# EAGLE board mbmc_single_board (EAGLE 9.6.2)
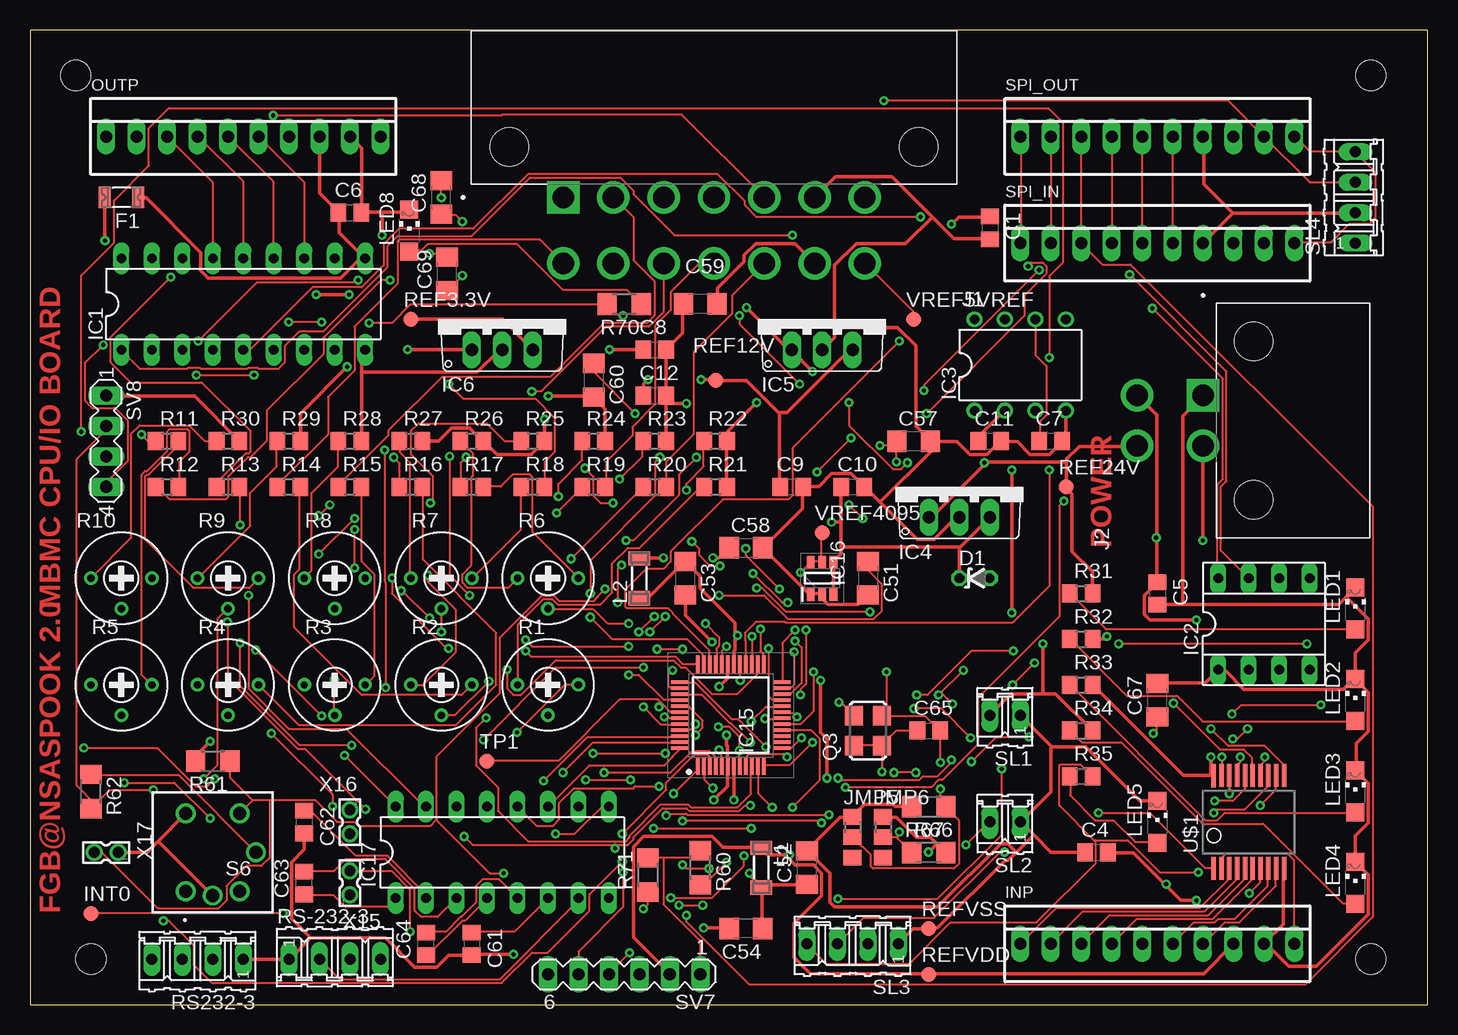
[diagram p1: board, top side]
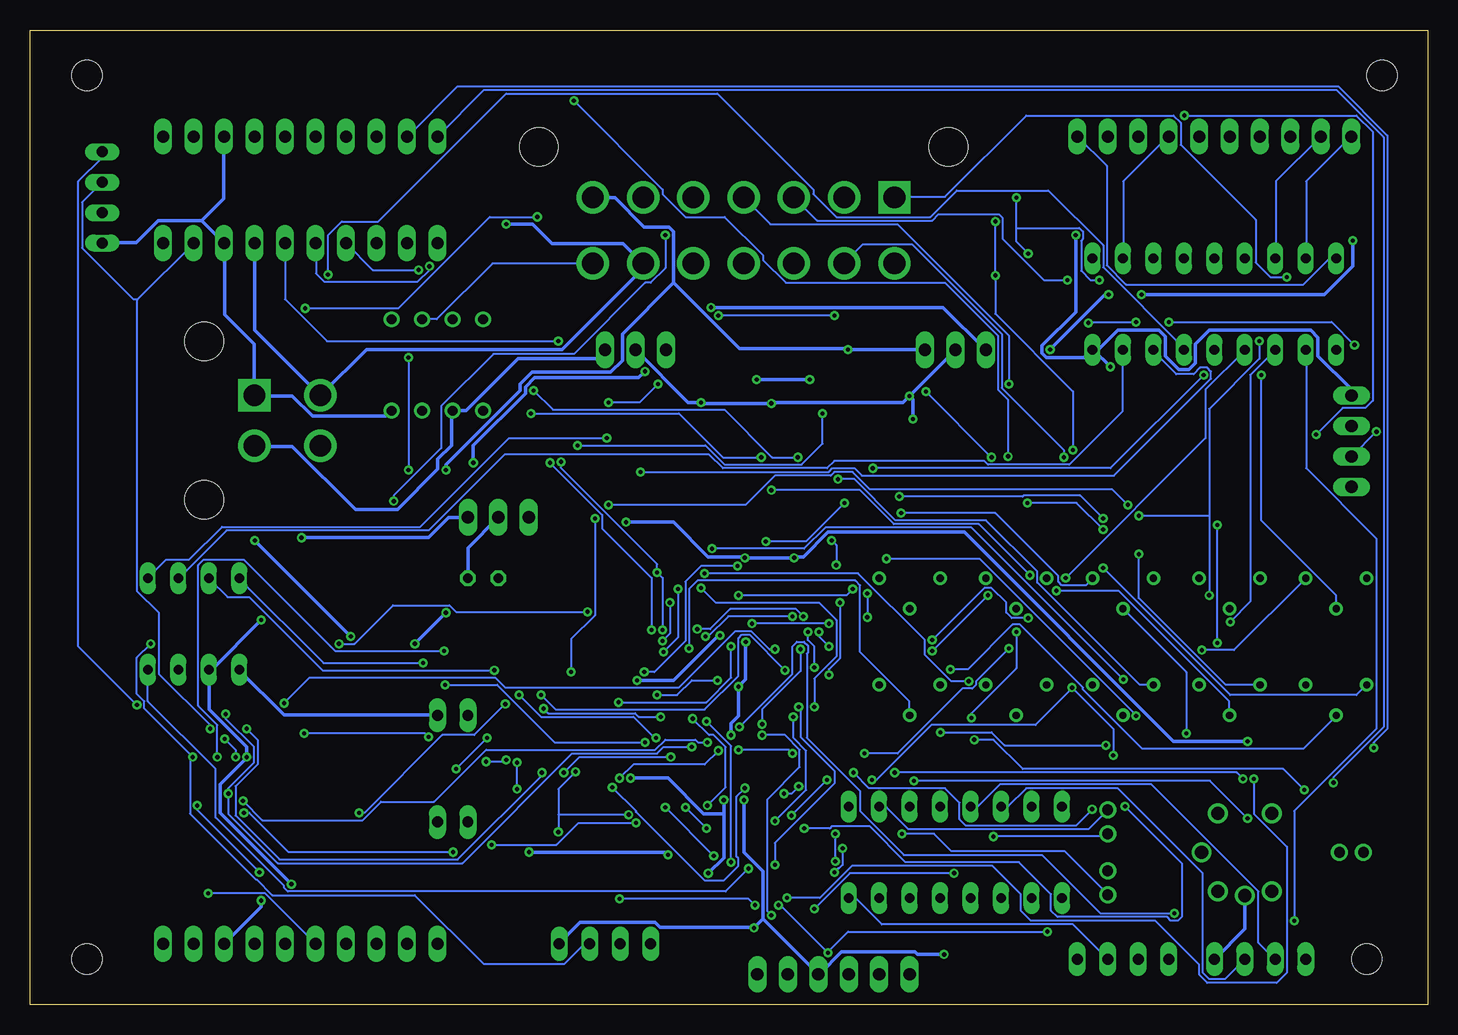
[diagram p2: board, bottom side, seen from below]

Size 116.51 x 81.27 mm. Coordinates in mm from the lower left corner, seen from the top.
Outline: 0,0 116.51,0 116.51,81.27 0,81.27 0,0
Copper layers (1*16): Top 0.035mm / dielectric 1.5mm / Bottom 0.035mm
Design rules "default": minimum track width 6mil, minimum drill 0.35mm, track to track 6mil, track to pad 6mil, pad to pad 6mil, via to via 6mil, smd to smd 6mil, copper to edge 40mil, drill to drill 6mil, minimum pad ring 10mil, minimum via ring 8mil, stop-mask expansion 4mil, vias tented up to drill 0mil, thermal gap 10mil
Net classes: 1 i-line: width 0.3 mm
Holes 2.5 mm at 5.08,3.81 111.76,3.81 111.76,77.47 3.81,77.47

## Footprints (pad centres in the part's own frame; a part is rotated, then mirrored left to right if it is on the bottom)
C0805 = smd 1.3 x 1.5: 1 -0.95,0; 2 0.95,0
C1206 = smd 1.6 x 1.8: 1 -1.4,0; 2 1.4,0
ZDIO-2.5 = drill 0.813 octagon: A 1.27,0; C -1.27,0
1206L = smd 1 x 1.8: 1 -1.4,0; 2 1.4,0
DIL18 = drill 0.813 long: 1 -10.16,-3.81; 2 -7.62,-3.81; 3 -5.08,-3.81; 4 -2.54,-3.81; 5 0,-3.81; 6 2.54,-3.81; 7 5.08,-3.81; 8 7.62,-3.81; 9 10.16,-3.81; 10 10.16,3.81; 11 7.62,3.81; 12 5.08,3.81; 13 2.54,3.81; 14 0,3.81; 15 -2.54,3.81; 16 -5.08,3.81; 17 -7.62,3.81; 18 -10.16,3.81
SOCKET-08 = drill 0.813 long: 1 -3.81,-3.81; 2 -1.27,-3.81; 3 1.27,-3.81; 4 3.81,-3.81; 5 3.81,3.81; 6 1.27,3.81; 7 -1.27,3.81; 8 -3.81,3.81
DIL08 = drill 0.813 pad 1.27: 1 -3.81,-3.81; 2 -1.27,-3.81; 3 1.27,-3.81; 4 3.81,-3.81; 5 3.81,3.81; 6 1.27,3.81; 7 -1.27,3.81; 8 -3.81,3.81
TO220V = drill 1.016 long: 1 -2.54,-2.54; 2 0,-2.54; 3 2.54,-2.54
QFP50P900X900X120-48N = smd 1.475 x 0.3: 1 -4.238,2.75; 2 -4.238,2.25; 3 -4.238,1.75; 4 -4.238,1.25; 5 -4.238,0.75; 6 -4.238,0.25; 7 -4.238,-0.25; 8 -4.238,-0.75; 9 -4.238,-1.25; 10 -4.238,-1.75; 11 -4.238,-2.25; 12 -4.238,-2.75; 25 4.238,-2.75; 26 4.238,-2.25; 27 4.238,-1.75; 28 4.238,-1.25; 29 4.238,-0.75; 30 4.238,-0.25; 31 4.238,0.25; 32 4.238,0.75; 33 4.238,1.25; 34 4.238,1.75; 35 4.238,2.25; 36 4.238,2.75 | smd 0.3 x 1.475: 13 -2.75,-4.238; 14 -2.25,-4.238; 15 -1.75,-4.238; 16 -1.25,-4.238; 17 -0.75,-4.238; 18 -0.25,-4.238; 19 0.25,-4.238; 20 0.75,-4.238; 21 1.25,-4.238; 22 1.75,-4.238; 23 2.25,-4.238; 24 2.75,-4.238; 37 2.75,4.238; 38 2.25,4.238; 39 1.75,4.238; 40 1.25,4.238; 41 0.75,4.238; 42 0.25,4.238; 43 -0.25,4.238; 44 -0.75,4.238; 45 -1.25,4.238; 46 -1.75,4.238; 47 -2.25,4.238; 48 -2.75,4.238
SOP95P280X145-6N = smd 1.075 x 0.65: 1 -1.338,0.95; 2 -1.338,0; 3 -1.338,-0.95; 4 1.338,-0.95; 5 1.338,0; 6 1.338,0.95
DIL16 = drill 0.813 long: 1 -8.89,-3.81; 2 -6.35,-3.81; 3 -3.81,-3.81; 4 -1.27,-3.81; 5 1.27,-3.81; 6 3.81,-3.81; 7 6.35,-3.81; 8 8.89,-3.81; 9 8.89,3.81; 10 6.35,3.81; 11 3.81,3.81; 12 1.27,3.81; 13 -1.27,3.81; 14 -3.81,3.81; 15 -6.35,3.81; 16 -8.89,3.81
22-23-2101 = drill 1 long: 1 -11.43,0; 2 -8.89,0; 3 -6.35,0; 4 -3.81,0; 5 -1.27,0; 6 1.27,0; 7 3.81,0; 8 6.35,0; 9 8.89,0; 10 11.43,0
B1,27 = smd 1.27 x 1.27: TP 0,0
TE_1-1586043-4 = drill 1.8 pad 2.15 square: 1 0,0 | drill 1.8 pad 2.15: 2 0,5.5; 3 -4.19,0; 4 -4.19,5.5; 5 -8.38,0; 6 -8.38,5.5; 7 -12.57,0; 8 -12.57,5.5; 9 -16.76,0; 10 -16.76,5.5; 11 -20.95,0; 12 -20.95,5.5; 13 -25.14,0; 14 -25.14,5.5 | hole 3.2: -29.64,-4.2; 4.5,-4.2
TE_1586044-4 = drill 1.8 pad 2.15 square: 1 0,0 | drill 1.8 pad 2.15: 2 0,5.5; 3 -4.19,0; 4 -4.19,5.5 | hole 3.2: -8.69,-4.2; 4.5,-4.2
A0R-JMP = smd 1.5 x 1.3: 1 0,1.7; 2 0,0; 3 0,-1.7
SM-1206 = smd 1.2 x 1.8: 1 -1.65,0; 2 1.65,0
CHIPLED_1206 = smd 1.5 x 1.5: A 0,-1.75; C 0,1.75
ASF = smd 1.6 x 1.5: 1 -1.25,-1.15; 2 1.25,-1.15; 3 1.25,1.15; 4 -1.25,1.15
RTRIM3339P = drill 0.61: 1 -2.54,0; 2 0,-2.54; 3 2.54,0
R0805 = smd 1.3 x 1.5: 1 -0.95,0; 2 0.95,0
R1206 = smd 1.6 x 1.803: 1 -1.422,0; 2 1.422,0
04P = drill 0.914 long: 1 -3.81,0; 2 -1.27,0; 3 1.27,0; 4 3.81,0
B3W-9_1-LED = drill 1.1 pad 1.65: 1 3.25,-2.25; 2 -3.25,-2.25; 3 3.25,2.25; 4 -3.25,2.25; 5 0,3.6; 6 3.6,0
02P = drill 0.914 long: 1 -1.27,0; 2 1.27,0
MA06-1 = drill 1.016 long: 1 -6.35,0; 2 -3.81,0; 3 -1.27,0; 4 1.27,0; 5 3.81,0; 6 6.35,0
MA04-1 = drill 1.016 long: 1 -3.81,0; 2 -1.27,0; 3 1.27,0; 4 3.81,0
SSOP20 = smd 0.381 x 1.93: CH_L 2.925,3.879; EN_L -2.925,-3.879; GND 2.925,-3.879; IN1 -2.275,-3.879; IN2 -1.625,-3.879; IN3 -0.975,-3.879; IN4 -0.325,-3.879; IN5 0.325,-3.879; IN6 0.975,-3.879; IN7 1.625,-3.879; IN8 2.275,-3.879; OUT1 -2.275,3.879; OUT2 -1.625,3.879; OUT3 -0.975,3.879; OUT4 -0.325,3.879; OUT5 0.325,3.879; OUT6 0.975,3.879; OUT7 1.625,3.879; OUT8 2.275,3.879; VCC -2.917,3.868
332-02 = drill 0.9 pad 1.27: 1 0,-1; 2 0,1

## Placement (x,y rotation side)
C1  22uf  [C0805]  80.01,64.77 270 top
C4  0.1  [C0805]  88.9,12.7 0 top
C5  0.1  [C0805]  93.98,34.29 270 top
C6  0.1  [C0805]  26.67,66.04 0 top
C7  0.1  [C0805]  85.09,46.99 0 top
C8  0.1  [C0805]  52.07,54.61 0 top
C9  0.1  [C0805]  63.5,43.18 0 top
C10  0.1  [C0805]  68.58,43.18 0 top
C11  0.1  [C0805]  80.01,46.99 0 top
C12  22uf  [C0805]  52.07,50.8 0 top
C51  0.1  [C1206]  69.85,35.56 270 top
C52  0.1  [C1206]  64.77,11.43 90 top
C53  0.1  [C1206]  54.61,35.56 270 top
C54  15uf  [C1206]  59.69,6.35 180 top
C57  0.1  [C1206]  73.66,46.99 0 top
C58  0.1  [C1206]  59.69,38.1 0 top
C59  15uf  [C1206]  55.88,58.42 180 top
C60  15uf  [C1206]  46.99,52.07 270 top
C61  1uf  [C0805]  36.83,5.08 270 top
C62  1uf  [C0805]  22.86,15.24 270 top
C63  1uf  [C0805]  22.86,10.16 90 top
C64  1uf  [C0805]  33.02,5.08 90 top
C65  1uf  [C0805]  74.93,22.86 0 top
C67  0.1  [C1206]  93.98,25.4 90 top
C68  0.1  [C1206]  34.29,67.31 90 top
C69  0.1  [C1206]  34.77,60.93 90 top
D1  5.6v  [ZDIO-2.5]  78.74,35.56 0 top
F1  1206L050  [1206L]  7.62,67.31 180 top
IC1  ULN2803  [DIL18]  17.78,58.42 0 top
IC2  DIP Socket  [SOCKET-08]  102.87,31.75 0 top
IC3  REF02 5 VOLTS  [DIL08]  82.55,53.34 0 top
IC4  5 VOLTS  [TO220V]  77.47,43.18 0 top
IC5  12 VOLTS  [TO220V]  66.04,57.15 0 top
IC6  3.3 VOLTS  [TO220V]  39.37,57.15 0 top
IC15  PIC18F57K42-E_PT  [QFP50P900X900X120-48N]  58.42,24.13 90 top
IC16  REF3440IDBVR  [SOP95P280X145-6N]  66.04,35.56 90 top
IC17  MAX232  [DIL16]  39.37,12.7 0 top
INP  22-23-2101  [22-23-2101]  93.98,5.08 0 top
INT0  TPB1,27  [B1,27]  5.08,7.62 0 top
J1  1-1586043-4  [TE_1-1586043-4]  44.45,67.31 180 top
J2  1586044-4  [TE_1586044-4]  97.79,50.8 90 top
JMP5  0R-JUMPA  [A0R-JMP]  68.58,13.97 0 top
JMP6  0R-JUMPA  [A0R-JMP]  71.12,13.97 0 top
L1  1000  [SM-1206]  60.96,11.43 270 top
L2  1000  [SM-1206]  50.8,35.56 90 top
LED1  24 on  [CHIPLED_1206]  110.49,33.02 0 top
LED2  12 on  [CHIPLED_1206]  110.49,25.4 0 top
LED3  5 on  [CHIPLED_1206]  110.49,17.78 0 top
LED4  3.3 on  [CHIPLED_1206]  110.49,10.16 0 top
LED5  debug8  [CHIPLED_1206]  93.98,15.24 0 top
LED8  DBLED  [CHIPLED_1206]  31.62,64.54 0 top
OUTP  22-23-2101  [22-23-2101]  17.78,72.39 0 top
Q3  ASF1  [ASF]  69.85,22.86 90 top
R1  200  [RTRIM3339P]  43.18,26.67 0 top
R2  200  [RTRIM3339P]  34.29,26.67 0 top
R3  200  [RTRIM3339P]  25.4,26.67 0 top
R4  200  [RTRIM3339P]  16.51,26.67 0 top
R5  200  [RTRIM3339P]  7.62,26.67 0 top
R6  200  [RTRIM3339P]  43.18,35.56 0 top
R7  200  [RTRIM3339P]  34.29,35.56 0 top
R8  200  [RTRIM3339P]  25.4,35.56 0 top
R9  200  [RTRIM3339P]  16.51,35.56 0 top
R10  200  [RTRIM3339P]  7.62,35.56 0 top
R11  9.85k  [R0805]  11.43,46.99 0 top
R12  21.5k  [R0805]  11.43,43.18 0 top
R13  811  [R0805]  16.51,43.18 0 top
R14  811  [R0805]  21.59,43.18 0 top
R15  9.85k  [R0805]  26.67,43.18 0 top
R16  9.85k  [R0805]  31.75,43.18 0 top
R17  9.85k  [R0805]  36.83,43.18 0 top
R18  9.85k  [R0805]  41.91,43.18 0 top
R19  811  [R0805]  46.99,43.18 0 top
R20  21.5k  [R0805]  52.07,43.18 0 top
R21  3820  [R0805]  57.15,43.18 0 top
R22  3820  [R0805]  57.15,46.99 0 top
R23  1.28k  [R0805]  52.07,46.99 0 top
R24  1.28k  [R0805]  46.99,46.99 0 top
R25  1.28k  [R0805]  41.91,46.99 0 top
R26  1.28k  [R0805]  36.83,46.99 0 top
R27  1.28k  [R0805]  31.75,46.99 0 top
R28  3820  [R0805]  26.67,46.99 0 top
R29  1.28k  [R0805]  21.59,46.99 0 top
R30  1.28k  [R0805]  16.51,46.99 0 top
R31  10k  [R0805]  87.63,34.29 0 top
R32  5k  [R0805]  87.63,30.48 0 top
R33  1k  [R0805]  87.63,26.67 0 top
R34  1k  [R0805]  87.63,22.86 0 top
R35  1k  [R0805]  87.63,19.05 0 top
R60  220  [R1206]  55.88,11.43 270 top
R61  10000  [R1206]  15.24,20.32 180 top
R62  220  [R1206]  5.08,17.78 270 top
R66  0  [R1206]  74.93,12.7 0 top
R67  0  [R1206]  74.93,16.51 180 top
R70  220  [R1206]  49.53,58.42 180 top
R71  220  [R1206]  51.51,10.82 90 top
REF3.3V  TPB1,27  [B1,27]  31.75,57.15 0 top
REF12V  TPB1,27  [B1,27]  57.15,52.07 0 top
REF24V  TPB1,27  [B1,27]  86.36,43.18 0 top
REFVDD  TPB1,27  [B1,27]  74.93,2.54 0 top
REFVSS  TPB1,27  [B1,27]  74.93,6.35 0 top
RS232-3  serial1  [04P]  13.97,3.81 180 top
RS-232-3  serial2  [04P]  25.4,3.81 0 top
S6  RESET SW  [B3W-9_1-LED]  15.24,12.7 270 top
SL1  3.3 GLORY  [02P]  81.28,24.13 180 top
SL2  PWM  [02P]  81.28,15.24 180 top
SL3  MISC INP  [04P]  68.58,5.08 180 top
SL4  SPI SEL  [04P]  110.49,67.31 90 top
SPI_IN  22-23-2101  [22-23-2101]  93.98,63.5 0 top
SPI_OUT  22-23-2101  [22-23-2101]  93.98,72.39 0 top
SV7  ICSP  [MA06-1]  49.53,2.54 180 top
SV8  DEBUG  [MA04-1]  6.35,46.99 270 top
TP1  TPB1,27  [B1,27]  38.1,20.32 0 top
U$1  MAX6818  [SSOP20]  101.6,15.24 0 top
VREF5VREF  TPB1,27  [B1,27]  73.66,57.15 0 top
VREF4095  TPB1,27  [B1,27]  66.04,39.37 0 top
X15  RX-2  [332-02]  26.67,10.16 0 top
X16  TX-2  [332-02]  26.67,15.24 180 top
X17  RESETJMP  [332-02]  6.35,12.7 90 top

## Tracks (layer width: path | path; a pad name or v marks a point on that pad's centre or on a via)
+3V3  (via drill 0.35)
  Top 0.3: 84.43,25.91 81.76,25.91 80.01,24.16 SL1.2 | 84.43,25.91 85.5,25.91 88.54,22.86 R34.2 | REF3.3V.TP 39.4,57.15 41.91,54.63 IC6.3 | v48.31,54.63 51.05,54.63 C8.1 | v84.43,30.1 84.43,25.91 | v81.84,44.58 v81.84,32.69
  Bottom 0.3: IC6.3 41.91,54.63 v48.31,54.63 48.39,54.71 57.38,54.71 62.87,60.2 | 62.87,60.2 62.87,64.47 63.25,64.85 65.3,64.85 67.74,67.28 69.57,67.28 J1.13 | v81.84,32.69 v84.43,30.1 | v81.84,44.58 81.84,45.03 75.67,51.21 75.67,51.74 74.68,52.73 68.12,52.73 67.13,53.72 67.13,55.93 62.87,60.2
+12V  (via drill 0.35)
  Top 0.3: R32.2 89.53,30.48 v89.76,30.71 | v97.77,38.71 97.77,46.56 J2.3 | C11.1 79.1,47.02 79.1,47.4 81.23,49.53 IC3.2 | 62.48,49.3 59.74,52.05 57.15,52.05 REF12V.TP 57.07,52.12 v55.93,52.12 | 62.48,49.3 62.48,43.2 C9.1 | v51.51,52.12 51.13,51.74 51.13,50.83 C12.1 | IC5.3 68.58,54.56 68.28,54.56 63.09,49.38 62.56,49.38 62.48,49.3
  Bottom 0.3: v97.77,38.71 v89.76,30.71 | v55.93,52.12 v51.51,52.12 | IC5.3 68.58,54.56 69.27,53.87 75.82,53.87 80.16,49.53 IC3.2 81.38,49.45 81.38,46.63 82.53,45.49 82.53,44.65 85.88,41.3 89.38,41.3 94.64,46.56 97.77,46.56 J2.3
+24V  (via drill 0.35)
  Top 0.3: 86.41,45.26 86.41,45.49 87.48,46.56 92.28,46.56 J2.4 | 86.41,45.26 86.41,43.2 REF24V.TP 86.41,43.05 86.87,42.6 86.87,37.8 88.54,36.12 88.54,34.29 R31.2 | 79.63,45.11 79.78,45.26 86.41,45.26 | 79.63,45.11 75.21,40.69 74.98,40.69 IC4.1 | v6.25,63.7 6.25,67.28 F1.2 | v26.59,59.21 v23.85,59.21 | v31.47,54.63 36.8,54.63 IC6.1 | v59.74,58.14 63.25,54.63 63.48,54.63 IC5.1 63.55,54.48 v65.23,52.81 | v79.55,45.19 79.63,45.11
  Bottom 0.3: v6.25,63.7 6.25,61.57 8.61,59.21 v23.85,59.21 | v26.59,59.21 26.9,59.21 v31.47,54.63 | v59.74,58.14 40.39,58.14 36.88,54.63 IC6.1 | v79.55,45.19 79.55,46.63 75.21,50.98 75.21,51.51 74.45,52.27 65.76,52.27 v65.23,52.81
AC_CHARGER  (via drill 0.35)
  Top 0.152: v47.85,19.36 53.42,19.36 55.24,21.18 56.62,21.18 57.15,20.65 57.15,19.96 IC15.4 | v27.96,16.31 22.94,21.34 22.33,21.34 16.46,27.2 v16.46,31.93
  Bottom 0.152: v47.85,19.36 46.56,18.06 40.23,18.06 39.01,16.84 39.01,15.47 38.48,14.94 29.34,14.94 v27.96,16.31 | v16.46,31.93 14.78,33.6 14.78,52.5 12.72,54.56 IC1.3
ANA0_IN_C_BAT  (via drill 0.35)
  Top 0.152: v11.73,60.66 6.71,55.63 6.71,53.57 8.38,51.89 14.33,51.89 18.36,47.85 18.36,46.1 18.21,45.95 17.98,45.95 15.62,43.59 15.62,43.2 R13.1
  Bottom 0.152: v11.73,60.66 13.11,60.66 14.33,61.87 14.33,65.46 20.57,71.7 20.57,73.53 21.18,74.14 33.45,74.14 40.23,67.36 44.42,67.36 J1.1
ANA1_IN_C-PV
  Top 0.152: R14.1 20.65,43.2 20.65,43.36 24.84,47.55 24.84,50.67 27.05,52.88 27.05,56.54 30.63,60.12 30.63,63.63 30.79,63.78 42.52,63.78 44.42,61.87 J1.2
ANA2_IN_V_CC
  Top 0.152: R15.1 25.76,43.2 25.76,43.36 29.87,47.47 29.87,47.85 34.37,52.35 43.36,52.35 47.85,56.84 51.44,56.84 52.05,57.45 52.05,60.35 50.29,62.1 50.29,65.68 48.69,67.28 J1.3
ANA4_IN_V_BAT  (via drill 0.35)
  Top 0.152: v30.33,45.64 30.79,45.19 30.79,43.2 R16.1
  Bottom 0.152: v30.33,45.64 30.33,46.25 35.51,51.44 35.51,55.93 42.98,63.4 47.09,63.4 48.62,61.87 J1.4
ANA5_IN_V_PV  (via drill 0.35)
  Top 0.152: v30.02,60.43 29.26,60.43 24.46,55.63 24.46,54.25 19.74,49.53 19.74,47.02 18.36,45.64 18.14,45.64 16.54,44.04 16.54,42.37 16.31,42.14 11.66,42.14 10.67,43.13 10.52,43.13 R12.1
  Bottom 0.152: v30.02,60.43 32,60.43 35.43,63.86 35.43,65.61 35.74,65.91 40.77,65.91 41.3,65.38 50.9,65.38 52.81,67.28 J1.5
ANA6_IN_V_CMODE  (via drill 0.35)
  Top 0.152: v36.35,45.64 35.89,45.19 35.89,43.2 R17.1 | v41.83,51.13 42.6,51.13 48.01,56.54 51.59,56.54 52.81,57.76 52.81,61.8 J1.6
  Bottom 0.152: v41.83,51.13 v36.35,45.64
ANB2_IN_V_BBAT  (via drill 0.35)
  Top 0.152: v34.9,51.74 36.12,50.52 42.14,50.52 43.74,48.92 43.74,46.1 42.9,45.26 42.9,43.2 R18.2
  Bottom 0.152: v34.9,51.74 34.9,55.78 44.2,65.08 54.79,65.08 57,67.28 J1.7
ANB3_IN_C_MPPT
  Top 0.152: R19.2 48.01,43.2 48.01,45.26 50.22,47.47 50.22,48.16 52.12,50.06 52.12,56.62 53.42,57.91 53.42,59.44 55.78,61.8 57,61.8 J1.8
ANB4_IN_V_INVERTER  (via drill 0.35)
  Top 0.152: v9.3,47.55 9.83,47.02 10.44,47.02 R11.1 | v20.27,74.14 39.32,74.14 39.4,74.22 54.33,74.22 61.19,67.36 J1.9
  Bottom 0.152: v9.3,47.55 7.09,49.76 5.18,49.76 4.57,50.37 4.57,72.77 5.94,74.14 v20.27,74.14
ANB5_IN_V_L_SENSOR
  Top 0.152: R20.2 53.03,43.2 53.03,45.26 55.32,47.55 55.32,54.41 58.52,57.61 58.52,59.13 61.19,61.8 J1.10
C_BATT  (via drill 0.35)
  Top 0.152: v61.57,29.72 61.57,25.76 61.87,25.45 62.64,25.45 IC15.21
  Bottom 0.152: v61.57,29.72 61.57,34.67 60.88,35.36 47.7,35.36 47.32,34.98 47.32,29.41 43.2,25.3 43.2,24.16 R1.2
C_MPPT  (via drill 0.35)
  Top 0.152: v61.87,16.46 60.73,17.6 60.73,19.89 IC15.11 | v51.97,14.71 v60.12,14.71 | v25.22,16.54 25.22,17.53 v20.12,22.63
  Bottom 0.152: v60.12,14.71 v61.87,16.46 | v51.97,14.71 49.84,14.71 49.68,14.86 46.48,14.86 43.51,11.89 34.06,11.89 31.39,9.22 31.39,7.85 30.86,7.32 21.72,7.32 21.41,7.01 20.8,7.01 20.5,7.32 20.5,11.81 v25.22,16.54 | v20.12,22.63 20.12,27.74 R8.2
C_PV  (via drill 0.35)
  Top 0.152: v63.78,30.33 64.31,29.79 64.31,26.82 63.4,25.91 62.71,25.91 IC15.22 | v63.17,33.53 62.71,33.53 v60.27,35.97 | v38.25,26.98 35.43,24.16 34.29,24.16 R2.2
  Bottom 0.152: v63.78,30.33 63.17,30.94 v63.17,33.53 | v60.27,35.97 47.47,35.97 41.91,30.4 41.91,29.18 39.7,26.98 v38.25,26.98
CAL_SW
  Top 0.152: U$1.IN5 101.88,11.35 101.88,10.44 98.6,7.16 92.28,7.16 90.22,5.11 INP.4
CALIB_B  (via drill 0.35)
  Top 0.152: v55.47,23.39 55.02,22.94 54.25,22.94 IC15.45 | v54.41,29.64 v52.27,29.64 | v95.33,25.15 99.21,21.26 101.19,21.26 101.88,20.57 101.88,19.13 U$1.OUT5
  Bottom 0.152: v55.47,23.39 55.47,24.61 52.27,27.81 v52.27,29.64 | v54.41,29.64 54.86,29.64 56.39,31.17 57.68,31.17 62.41,26.44 76.89,26.44 77.72,27.28 93.19,27.28 v95.33,25.15
CLK16MHZCPU  (via drill 0.35)
  Top 0.152: v58.06,29.87 57.68,29.49 57.68,28.42 IC15.32 | v67.44,25.22 67.59,25.22 68.66,24.16 Q3.3
  Bottom 0.152: v58.06,29.87 58.06,27.28 60.12,25.22 v67.44,25.22
DAQ_CS0  (via drill 0.35)
  Top 0.152: v99.36,20.65 99.36,19.13 U$1.OUT1 | v100.28,22.17 100.66,22.17 v101.5,23.01 | v41.3,29.49 41.76,29.03 53.8,29.03 54.41,28.42 55.63,28.42 IC15.36 | v36.65,34.14 34.98,35.81 v34.98,45.72 | v71.17,75.36 99.9,75.36 SPI_OUT.9 106.68,68.58 SL4.3
  Bottom 0.152: v99.36,20.65 99.36,21.26 v100.28,22.17 | v101.5,23.01 101.5,23.32 105.77,27.58 105.77,32.69 107.59,34.52 107.59,58.75 107.56,58.79 | 107.56,58.79 102.87,63.48 SPI_IN.9 | v36.65,34.14 v41.3,29.49 | v34.98,45.72 34.98,50.44 35.81,51.28 35.81,55.78 40.23,60.2 53.49,60.2 55.4,62.1 55.4,62.48 58.6,65.68 61.87,65.68 63.78,67.59 63.78,67.97 v71.17,75.36 | SL4.3 112.17,66.9 112.17,63.09 107.9,58.83 107.59,58.83 107.56,58.79
DEBUG8_LED  (via drill 0.35)
  Top 0.152: 88.73,13.68 88.85,13.56 88.85,11.81 83.9,6.86 76.73,6.86 73.3,3.43 66.37,3.43 64.77,5.03 SL3.4 | 88.73,13.68 85.8,16.61 85.8,19.96 85.88,20.04 87.55,20.04 88.54,19.05 R35.2 | v102.56,16.61 103.86,17.91 103.86,19.05 U$1.OUT8 | v97.38,11.05 94.18,11.05 91.52,13.72 88.77,13.72 88.73,13.68
  Bottom 0.152: v102.56,16.61 102.56,16.23 v97.38,11.05
DIP_P5  (via drill 0.35)
  Top 0.152: v68.43,47.24 v65.61,44.42
  Bottom 0.152: v65.61,44.42 49.91,44.42 49.61,44.73 47.78,44.73 47.17,44.12 26.14,44.12 18.06,52.2 18.06,52.81 18.36,53.11 18.97,53.11 19.51,52.58 20.95,52.58 22.25,53.87 22.25,53.95 22.86,54.56 IC1.7 | v68.43,47.24 76.58,47.24 83.97,39.85 100.51,39.85 103.25,37.11 105.16,37.11 106.68,35.59 IC2.5
DIP_P6
  Bottom 0.152: IC2.6 104.09,35.59 100.13,39.55 83.29,39.55 76.96,45.87 59.89,45.87 58.75,44.73 50.06,44.73 49.45,45.34 36.96,45.34 36.65,45.03 29.87,45.03 25.45,49.45 25.45,54.56 IC1.8
DLED  (via drill 0.35)
  Top 0.152: v59.21,27.05 59.21,28.35 IC15.29 | v64.24,25.83 64.24,26.29 64.69,26.75 v64.69,31.24 | v73.15,45.19 72.62,44.65 71.93,44.65 68.28,48.31 v68.28,50.22 | v64.16,51.74 59.13,56.77 v59.13,57.45 | v49.45,57.45 49.07,57.45 48.16,58.37 R70.2 48.08,58.37 31.7,58.37 30.18,56.84 v28.27,56.84 | v6.1,55.02 4.57,53.49 4.57,50.37 5.18,49.76 7.09,49.76 8.15,48.69 8.15,45.34 6.4,43.59 6.4,43.2 SV8.4 | v24.31,56.92 v21.57,56.92
  Bottom 0.152: v59.21,27.05 61.34,27.05 62.56,25.83 v64.24,25.83 | v64.69,31.24 64.69,35.59 68.81,39.7 68.81,40.84 v73.15,45.19 | v68.28,50.22 65.68,50.22 v64.16,51.74 | v49.45,57.45 v59.13,57.45 | v6.1,55.02 8,56.92 v21.57,56.92 | v24.31,56.92 28.19,56.92 v28.27,56.84
ENTER_B  (via drill 0.35)
  Top 0.152: v60.05,21.87 58.45,23.47 58.37,23.47 56.01,25.83 54.25,25.83 IC15.39 | v98.75,16.99 100.28,16.99 101.27,17.98 101.27,19.05 U$1.OUT4
  Bottom 0.152: v60.05,21.87 60.81,21.87 61.04,22.1 63.55,22.1 64.39,21.26 78.49,21.26 82.83,16.92 87.25,16.92 88.77,15.39 97.16,15.39 v98.75,16.99
EXT_INT0  (via drill 0.35)
  Top 0.152: v21.11,7.62 INT0.TP | v57.38,23.16 58.29,23.16 59.13,22.33 v59.13,21.18 59.13,19.96 IC15.8 | v93.65,22.63 93.95,22.94 93.95,23.93 C67.1 | v83.29,22.33 80.54,22.33 v78.49,20.27 | v76.81,20.42 76.81,20.19 75.67,19.05 74.45,19.05 74.14,18.75 67.51,18.75 v67.36,18.9
  Bottom 0.152: v21.11,7.62 27.28,7.62 32.16,12.5 43.66,12.5 47.32,16.15 47.32,17.83 51.74,22.25 51.74,29.26 51.66,29.34 51.66,29.95 51.97,30.25 52.58,30.25 52.96,29.87 52.96,27.58 v57.38,23.16 | v93.65,22.63 83.59,22.63 v83.29,22.33 | v78.49,20.27 76.96,20.27 v76.81,20.42 | v67.36,18.9 66.22,20.04 60.27,20.04 v59.13,21.18
EXT_INT1  (via drill 0.35)
  Top 0.152: v63.09,20.65 62.87,20.88 59.89,20.88 59.74,20.73 59.74,19.96 IC15.9 | v73.84,19.36 v72.01,19.36 | v98.45,23.01 99.9,21.57 102.95,21.57 104.47,20.04 104.47,19.13 U$1.CH_L
  Bottom 0.152: v63.09,20.65 70.71,20.65 v72.01,19.36 | v73.84,19.36 73.84,19.13 80.85,12.12 95.71,12.12 99.36,15.77 99.36,18.21 97.54,20.04 97.54,22.1 v98.45,23.01
GND  (via drill 0.35)
  Top 0.152: 71.4,24.08 71.02,24.08 Q3.2 71.4,24.08 | 71.4,24.08 74.6,24.08 75.82,22.86 C65.2 75.89,22.86 v75.89,20.19 | JMP5.2 68.58,13.95 69.34,13.18 69.42,13.18 70.1,12.5 70.1,11.51 70.26,11.35 77.04,11.35 77.42,11.73 77.42,15.39 76.35,16.46 R67.1 76.28,16.54 75.89,16.92 v75.89,17.98 | v34.29,67.28 C68.2 | v33.3,62.64 34.52,62.64 34.75,62.41 C69.2 | v18.21,34.14 18.21,26.36 21.57,23.01 26.36,23.01 32.84,16.54 32.99,16.54 IC17.15 | v14.02,55.32 18.9,60.2 27.13,60.2 v27.36,60.43 | v71.4,27.74 71.4,24.08 | v68.28,41.68 v69.42,40.54 | v24.08,40.77 v24.99,41.68
  Bottom 0.152: v75.89,17.98 v75.89,20.19 | 34.29,64.77 34.29,63.63 v33.3,62.64 | 34.29,64.77 v34.29,67.28 | 18.21,40.77 18.21,49.68 14.02,53.87 v14.02,55.32 | 18.21,40.77 v18.21,34.14 | v27.36,60.43 28.12,60.43 28.88,61.19 28.88,63.7 28.73,63.86 28.73,64.47 29.03,64.77 34.29,64.77 | v71.4,27.74 71.4,30.48 69.42,32.46 v69.42,40.54 | v68.28,41.68 56.84,41.68 54.41,44.12 49.76,44.12 49.45,44.42 47.93,44.42 46.48,42.98 26.29,42.98 v24.99,41.68 | 18.21,40.77 v24.08,40.77
I5_ULN2803  (via drill 0.35)
  Top 0.152: v65.23,21.87 63.32,19.96 61.19,19.96 IC15.12 | v83.74,28.5 v81.92,26.67 | v74.22,65.68 60.58,65.68 59.59,66.67 59.59,66.98 57.3,69.27 41.53,69.27 36.96,64.69 30.79,64.69 29.49,63.4 29.49,61.65 27.66,59.82 23.55,59.82 18.36,54.63 17.83,54.63 IC1.5 | v93.57,58.06 99.44,52.2 99.44,43.81 98.98,43.36 98.98,35.66 99.06,35.59 IC2.8
  Bottom 0.152: v65.23,21.87 72.77,21.87 77.57,26.67 v81.92,26.67 | v83.74,28.5 92.05,28.5 99.06,35.51 IC2.8 | v74.22,65.68 78.18,65.68 85.8,58.06 v93.57,58.06
IO_RF1  (via drill 0.35)
  Top 0.152: SPI_OUT.10 105.46,72.39 106.68,71.17 110.49,71.17 SL4.4 110.49,71.09 112.17,69.42 112.17,65.61 111.63,65.08 109.96,65.08 108.43,63.55 105.46,63.55 SPI_IN.10 | v61.34,21.49 59.05,23.77 58.52,23.77 55.47,26.82 54.25,26.82 IC15.37 | v99.97,17.6 99.97,19.05 U$1.OUT2 | v107.59,24.99 100.97,24.99 v100.2,24.23
  Bottom 0.152: v61.34,21.49 63.7,21.49 64.24,20.95 71.32,20.95 80.47,11.81 95.86,11.81 99.97,15.93 v99.97,17.6 99.97,18.06 97.84,20.19 97.84,21.49 100.2,23.85 v100.2,24.23 | SL4.4 110.49,70.64 112.47,68.66 112.47,29.87 v107.59,24.99
MAX_EN1  (via drill 0.35)
  Top 0.152: v64.31,22.25 63.48,21.41 62.71,21.41 IC15.13 | v77.8,27.89 v75.74,25.83 75.97,25.98 v76.89,25.07 | v89.08,16 93.34,16 97.92,11.43 98.6,11.43 U$1.EN_L | v91.67,60.88 99.75,52.81 99.75,43.66 99.29,43.2 99.29,37.87 IC2.7
  Bottom 0.152: v64.31,22.25 64.47,22.25 66.22,24 73.91,24 v75.74,25.83 | v77.8,27.89 92.13,27.89 98.22,33.98 100.05,33.98 101.58,35.51 IC2.7 | v89.08,16 88.62,16 82.14,22.48 79.48,22.48 v76.89,25.07 | v91.67,60.88 91.67,64.16 90.53,65.3 87.48,65.3 76.81,75.97 59.21,75.97 51.21,67.97 51.21,67.59 49.3,65.68 41.45,65.68 39.24,67.89 31.62,67.89 27.05,63.32 27.05,61.49 20.34,54.79 20.34,54.63 IC1.6
N$1
  Top 0.152: R11.2 12.34,46.94 12.34,46.63 9.91,44.2 9.75,44.2 9.6,44.04 9.6,38.79 13.64,34.75 18.29,34.75 19.05,35.51 R9.3
N$2
  Top 0.152: R12.2 12.42,43.2 12.42,45.26 13.26,46.1 13.26,47.85 13.11,48.01 11.66,48.01 11.43,47.78 11.43,46.18 9.75,44.5 9.6,44.5 9.3,44.2 9.3,27.51 10.13,26.67 R5.3
N$3  (via drill 0.35)
  Top 0.152: v17.53,40.01 17.53,43.13 R13.2 | v17.53,30.18 17.53,26.59 22.48,21.64 v26.82,21.64 | v40.62,22.71 44.58,26.67 R1.3
  Bottom 0.152: v17.53,30.18 v17.53,40.01 | v26.82,21.64 35.28,21.64 36.35,22.71 v40.62,22.71
N$4
  Top 0.152: R14.2 22.48,43.13 22.48,36.35 22.02,35.89 22.02,31.47 27.66,25.83 35.97,25.83 36.8,26.67 R2.3
N$5
  Top 0.152: R15.2 27.66,43.13 27.66,36.96 28.73,35.89 28.73,27.43 27.96,26.67 R3.3
N$6
  Top 0.152: R4.3 22.4,23.32 35.51,23.32 38.86,26.67 38.86,31.01 32.77,37.11 32.77,43.13 R16.2
N$7
  Top 0.152: R17.2 37.8,43.2 39.24,43.2 40.23,44.2 41.68,44.2 41.91,43.97 41.91,39.4 45.72,35.59 R6.3
N$9  (via drill 0.35)
  Top 0.152: v43.89,41 46.02,43.13 R19.1
  Bottom 0.152: v43.89,41 36.04,41 30.79,35.74 30.79,35.28 30.48,34.98 28.5,34.98 27.96,35.51 R8.3
N$11
  Top 0.152: R21.1 56.16,43.13 55.85,43.13 50.83,38.1 49.84,38.1 48.54,36.8 48.54,34.37 47.55,33.38 43.97,33.38 43.51,33.83 42.82,33.83 40.69,31.7 40.69,26.67 R1.1
N$12  (via drill 0.35)
  Top 0.152: v54.71,42.9 54.71,43.43 56.16,44.88 56.16,46.94 R22.1 | v33.15,35.81 33.15,35.28 35.51,32.92 35.51,29.41 32.77,26.67 R2.1
  Bottom 0.152: v54.71,42.9 47.32,42.9 44.5,40.08 37.41,40.08 v33.15,35.81
N$13  (via drill 0.35)
  Top 0.152: v49.15,43.81 51.05,45.72 51.05,46.94 R23.1
  Bottom 0.152: v49.15,43.81 47.78,43.81 44.35,40.39 36.8,40.39 32.54,36.12 32.54,35.2 24,26.67 R3.1
N$14  (via drill 0.35)
  Top 0.152: v44.04,42.37 44.04,43.43 46.02,45.41 46.02,46.94 R24.1 | v24.08,37.57 v27.05,40.54
  Bottom 0.152: v44.04,42.37 33.76,42.37 33.68,42.44 28.96,42.44 v27.05,40.54 | v24.08,37.57 24.08,33.91 16.84,26.67 R4.1
N$15  (via drill 0.35)
  Top 0.152: v33.38,41.83 33.6,42.06 33.6,44.04 31.77,45.87 31.77,47.85 32.38,48.46 38.1,48.46 39.55,47.02 40.92,47.02 R25.1 | v27.05,36.42 v27.05,39.62
  Bottom 0.152: v33.38,41.83 29.26,41.83 v27.05,39.62 | v27.05,36.42 16.46,25.83 5.94,25.83 5.11,26.67 R5.1
N$16
  Top 0.152: R26.1 35.89,46.94 36.58,46.25 36.65,46.25 36.96,45.95 36.96,44.12 36.8,43.97 36.8,36.65 36.04,35.89 36.04,35.2 36.5,34.75 39.85,34.75 40.62,35.51 R6.1
N$17
  Top 0.152: R27.1 30.86,46.94 30.86,46.02 31.7,45.19 31.7,35.59 R7.1
N$18
  Top 0.152: R28.1 25.68,46.94 25.68,44.88 23.47,42.67 23.47,36.2 22.86,35.59 R8.1
N$19
  Top 0.152: R29.1 20.57,46.94 20.57,44.88 18.36,42.67 18.36,39.93 14.02,35.59 R9.1
N$20
  Top 0.152: R10.1 8.46,38.94 8.46,47.62 9.14,48.31 13.26,48.31 14.55,47.02 15.54,47.02 R30.1
N$22  (via drill 0.35)
  Top 0.3: 58.75,30.79 58.75,31.85 55.85,34.75 55.85,35.74 54.63,36.96 C53.1 54.48,36.88 51.59,33.98 50.83,33.98 L2.1 | 58.75,30.79 58.75,29.57 58.67,29.49 58.67,28.42 IC15.30 | v58.67,17.07 IC15.7 | v59.97,10.97 59.97,10.82 60.96,9.83 L1.2 | C54.1 61.04,6.4 61.04,9.68 L1.2 | C52.1 64.77,9.98 60.96,9.98 L1.2 | v58.98,30.79 58.75,30.79 | v65.91,27.05 65.91,22.71 66.45,22.17 v66.45,18.9
  Bottom 0.3: 58.67,15.93 58.67,12.27 v59.97,10.97 | 58.67,15.93 v58.67,17.07 | v58.98,30.79 59.13,30.79 62.87,27.05 v65.91,27.05 | v66.45,18.9 63.32,18.9 60.35,15.93 58.67,15.93
N$44
  Top 0.152: U$1.IN1 99.36,11.43 99.36,12.27 99.67,12.57 104.85,12.57 105.39,12.04 105.39,5.11 INP.10
N$46
  Top 0.152: U$1.IN2 99.97,10.52 97.54,8.08 85.57,8.08 82.6,5.11 INP.1
N$47
  Top 0.152: INP.2 87.78,7.77 97.92,7.77 100.58,10.44 100.58,11.35 U$1.IN3
N$48
  Top 0.152: U$1.IN4 101.27,10.52 98.22,7.47 89.99,7.47 87.63,5.11 INP.3
N$50  (via drill 0.35)
  Top 0.152: v101.65,9.3 102.56,10.21 U$1.IN6
  Bottom 0.152: v101.65,9.3 96.93,9.3 INP.5
N$51
  Top 0.152: U$1.IN7 103.17,11.35 103.17,9.91 100.43,7.16 99.06,7.16 98.75,6.86 97,6.86 95.25,5.11 INP.6
N$52
  Top 0.152: U$1.IN8 103.86,11.35 103.86,9.91 100.81,6.86 99.59,6.86 97.84,5.11 INP.7
N$53
  Bottom 0.152: IC1.18 7.62,62.18 8.23,62.18 10.36,60.05 25.15,60.05 26.75,61.65 26.75,69.95 29.18,72.39 OUTP.10
N$54
  Bottom 0.152: IC1.17 10.13,62.26 10.13,68.66 6.4,72.39 OUTP.1
N$55
  Bottom 0.152: IC1.16 12.65,62.26 12.65,68.66 8.91,72.39 OUTP.2
N$56
  Top 0.152: IC1.15 15.24,68.58 OUTP.3
N$57
  Top 0.152: IC1.14 17.75,62.26 17.75,68.66 14.02,72.39 OUTP.4
N$58
  Top 0.152: IC1.13 20.27,62.26 20.27,68.66 16.54,72.39 OUTP.5
N$59
  Top 0.152: IC1.12 22.86,68.58 OUTP.6
N$60
  Bottom 0.152: IC1.11 25.38,62.26 25.38,68.66 21.64,72.39 OUTP.7
N$67  (via drill 0.35)
  Top 0.152: v42.82,18.67 46.48,22.33 54.18,22.33 IC15.46 | v15.01,15.54 12.04,18.52 v7.85,18.52 | SPI_IN.1 82.6,63.55 82.6,72.39 SPI_OUT.1
  Bottom 0.152: v42.82,18.67 18.14,18.67 v15.01,15.54 | v7.85,18.52 7.85,18.97 3.66,23.16 3.66,72.31 7.62,76.28 78.64,76.28 82.53,72.39 SPI_OUT.1
N$76
  Top 0.152: LED1.A 110.49,31.32 89.69,31.32 86.72,34.29 R31.1
N$77
  Top 0.152: LED2.A 110.49,23.62 97.77,23.62 95.63,25.76 91.44,25.76 86.72,30.48 R32.1
N$78
  Top 0.152: LED3.A 110.49,16 99.59,16 98.98,15.39 97.99,15.39 86.72,26.67 R33.1
N$79
  Top 0.152: LED4.A 110.49,8.46 109.42,8.46 102.79,15.09 97.77,15.09 90.98,21.87 87.71,21.87 86.72,22.86 R34.1
N$80
  Top 0.152: LED5.A 93.95,13.56 92.13,13.56 90.3,15.39 88.77,15.39 86.72,17.45 86.72,19.05 R35.1
N$83  (via drill 0.35)
  Top 0.152: v45.11,37.19 51.05,43.13 R20.1 | v18.82,29.57 v24.31,24.08
  Bottom 0.152: v45.11,37.19 37.34,37.19 24.31,24.16 v24.31,24.08 | v18.82,29.57 16.15,29.57 R10.3
N$88
  Top 0.152: R18.1 40.92,43.13 40.92,39.62 36.88,35.59 R7.3
N$231  (via drill 0.35)
  Top 0.152: v60.12,23.62 61.34,24.84 62.64,24.84 IC15.20 | v58.06,11.89 56.24,10.06 55.93,10.06 R60.2
  Bottom 0.152: v60.12,23.62 58.06,21.57 v58.06,11.89
N$232  (via drill 0.35)
  Top 0.152: v63.93,24 63.63,24.31 62.71,24.31 IC15.19 | v73.69,24.69 75.97,24.69 v78.41,22.25 | v81,19.66 81,14.17 75.67,8.84 v67.36,8.84 | v54.1,8.31 v56.08,8.31 | v49.99,4.34 48.23,2.59 SV7.4 | v31.7,6.1 31.7,9.6 30.18,11.12 26.67,11.12 X15.2
  Bottom 0.152: v63.93,24 65.76,24 66.06,24.31 73.3,24.31 v73.69,24.69 | v81,19.66 v78.41,22.25 | v67.36,8.84 56.62,8.84 v56.08,8.31 | v54.1,8.31 53.95,8.31 v49.99,4.34 49.99,4.42 48.31,6.1 v31.7,6.1
N$233  (via drill 0.35)
  Top 0.152: v61.27,23.85 62.64,23.85 IC15.18 | v60.05,16.61 59.59,16.61 59.13,16.15 54.94,16.15 54.71,16.38 52.73,16.38 50.29,13.95 50.29,13.79 49.84,13.34 48.77,13.34 | 48.77,13.34 36.88,13.34 v36.2,14.02 | SV7.5 45.72,4.42 49.45,8.15 v49.45,11.05 | 48.77,13.34 v48.77,13.03
  Bottom 0.152: v61.27,23.85 59.89,22.48 59.51,22.48 58.52,21.49 58.52,18.14 v60.05,16.61 | v36.2,14.02 26.82,14.02 26.67,14.17 X16.2 | v49.45,11.05 49.15,11.35 49.07,11.35 48.77,11.66 v48.77,13.03
N$236
  Top 0.152: IC17.6 40.39,6.1 36.88,6.1 C61.1
N$237
  Top 0.152: C62.1 22.86,16.15 23.39,16.15 27.13,12.42 29.79,12.42 32.99,9.22 32.99,8.91 IC17.2
N$238
  Top 0.152: C63.1 22.86,9.14 25.3,9.14 26.29,8.15 29.79,8.15 30.48,8.84 IC17.1
N$239
  Top 0.152: C64.1 33.07,4.19 33.22,4.19 36.04,7.01 36.27,7.01 38.1,8.84 IC17.4
N$240
  Top 0.152: IC17.5 39.09,10.44 37.72,10.44 37.19,9.91 37.19,8.53 35.97,7.32 35.89,7.32 34.67,6.1 33.07,6.1 C64.2
N$241
  Top 0.152: IC17.3 33.98,7.32 32.61,7.32 32.08,7.85 32.08,9.68 29.64,12.12 26.29,12.12 25.3,11.12 22.86,11.12 C63.2
N$245  (via drill 0.35)
  Top 0.152: v53.65,17.6 55.63,19.58 55.63,19.89 IC15.1 | v52.43,18.21 50.44,18.21 50.29,18.06 45.34,18.06 44.12,16.84 44.12,15.47 43.59,14.94 42.22,14.94 IC17.12
  Bottom 0.152: v53.65,17.6 53.03,17.6 v52.43,18.21
N$246  (via drill 0.35)
  Top 0.152: v43.81,14.25 45.41,14.25 47.62,16.46 48.23,16.46 IC17.9
  Bottom 0.152: v43.81,14.25 41.15,14.25 39.7,12.8 30.25,12.8 26.67,9.22 X15.1
N$247
  Top 0.152: IC17.11 46.63,19.96 52.88,19.96 53.57,20.65 53.57,20.73 54.18,21.34 IC15.48
N$248
  Bottom 0.152: IC17.10 45.72,16.46 45.11,16.46 43.28,14.63 28.27,14.63 X16.1
N$249
  Top 0.152: R62.1 5.11,19.13 12.42,19.13 18.82,12.72 S6.5
N$250  (via drill 0.35)
  Top 0.152: v60.2,30.71 60.2,28.42 IC15.27 | v51.66,31.09 v52.96,32.38 | v51.13,28.12 43.81,28.12 v37.8,22.1 | v10.29,17.91 6.63,17.91 5.11,16.38 R62.2 5.41,16.76 3.89,18.29 3.89,45.49 6.33,47.93 6.33,48.23 SV8.2
  Bottom 0.152: v60.2,30.71 59.97,30.71 58.29,32.38 v52.96,32.38 | v51.66,31.09 51.66,30.4 51.13,29.87 v51.13,28.12 | v37.8,22.1 36.2,22.1 33.76,19.66 12.04,19.66 v10.29,17.91
N$251  (via drill 0.35)
  Top 0.152: v84.96,44.58 84.96,34.9 81.92,31.85 63.02,31.85 62.94,31.93 60.5,31.93 59.59,31.01 59.59,30.4 59.66,30.33 59.66,28.42 IC15.28 | v84.96,53.95 84.96,60.73 86.11,61.87 86.11,73.53 84.89,74.75 11.58,74.75 9.91,73.08 9.91,69.95 7.01,67.06 7.01,63.55 4.27,60.81 v4.27,47.78
  Bottom 0.152: v84.96,53.95 v84.96,44.58 | v4.27,47.78 6.33,45.72 SV8.3
N$255  (via drill 0.35)
  Top 0.152: 52.69,25.11 53.42,24.38 IC15.42 | 52.69,25.11 52.35,25.45 49.15,25.45 44.04,20.34 38.1,20.34 TP1.TP | v56.62,11.35 54.71,11.35 v54.41,11.66 | 52.69,25.11 v52.43,24.84
  Bottom 0.152: IC2.4 106.68,25.3 101.04,19.66 101.04,15.62 95.33,9.91 95.33,9.75 95.02,9.45 58.52,9.45 v56.62,11.35 | v54.41,11.66 54.41,13.49 49.45,18.44 49.45,19.51 52.27,22.33 52.27,24.69 v52.43,24.84
N$257  (via drill 0.35)
  Top 0.152: v44.42,19.36 46.94,21.87 IC15.47 | v15.39,18.82 14.78,18.21 13.79,18.21 10.59,21.41 v4.5,21.41 | SPI_IN.2 85.11,63.55 85.11,72.39 SPI_OUT.2
  Bottom 0.152: v44.42,19.36 15.93,19.36 v15.39,18.82 | v4.5,21.41 4.5,21.87 3.35,23.01 3.35,72.47 7.47,76.58 80.85,76.58 85.04,72.39 SPI_OUT.2
N$258  (via drill 0.35)
  Top 0.152: v55.47,22.48 56.08,23.09 56.08,23.7 54.94,24.84 54.25,24.84 IC15.41 | v54.71,7.47 54.71,6.93 59.97,1.68 106.3,1.68 111.94,7.32 111.94,41.53 91.75,61.72 89.38,61.72 87.63,63.48 SPI_IN.3 SPI_OUT.3
  Bottom 0.152: v55.47,22.48 53.57,22.48 52.35,21.26 52.35,19.81 55.02,17.14 55.02,7.77 v54.71,7.47
N$259  (via drill 0.35)
  Top 0.152: v46.71,32.31 48.54,30.48 54.79,30.48 56.16,29.11 56.16,28.42 IC15.35 | v46.71,34.29 46.71,37.03 52.12,42.44 52.12,45.26 v52.5,45.64 | v74.52,51.21 74.52,51.66 v84.12,61.27 | SPI_OUT.4 90.22,72.39 90.22,63.55 SPI_IN.4
  Bottom 0.152: v46.71,34.29 v46.71,32.31 | v52.5,45.64 54.63,45.64 58.6,49.61 72.92,49.61 v74.52,51.21 | v84.12,61.27 87.94,61.27 SPI_IN.4
N$260  (via drill 0.35)
  Top 0.152: v49.91,27.51 50.75,27.51 52.81,25.45 54.18,25.45 IC15.40 | v49,33.53 49,36.35 v49.3,36.65 | v49.68,38.71 50.29,38.71 54.1,42.52 54.1,44.2 v55.55,45.64 | v74.75,49.3 82.91,57.45 82.91,59.13 84.73,60.96 84.73,61.57 84.43,61.87 83.52,61.87 v83.21,61.57 | SPI_OUT.5 92.73,72.39 92.73,63.55 SPI_IN.5
  Bottom 0.152: v49.91,27.51 49.91,27.96 49,28.88 v49,33.53 | v49.3,36.65 49.3,38.33 v49.68,38.71 | v55.55,45.64 58.75,45.64 62.41,49.3 v74.75,49.3 | v83.21,61.57 83.21,61.27 84.2,60.27 91.97,60.27 92.66,60.96 92.66,63.48 SPI_IN.5
N$261  (via drill 0.35)
  Top 0.152: v72.47,55.32 63.55,46.41 63.55,42.44 63.25,42.14 57.76,42.14 53.42,37.8 53.42,36.96 52.81,36.35 51.36,36.35 49.61,34.59 49.61,33.22 49.76,33.07 53.19,33.07 53.57,32.69 53.57,32.61 56.62,29.57 56.62,28.42 IC15.34 | SPI_IN.6 SPI_OUT.6
  Bottom 0.152: v72.47,55.32 91.75,55.32 95.25,58.83 SPI_IN.6
N$295
  Top 0.152: LED8.A 31.62,62.87 32.61,62.87 33.15,63.4 40.62,63.4 44.42,59.59 49.76,59.59 50.9,58.45 R70.1
N$299  (via drill 0.35)
  Top 0.152: v57.45,34.14 61.19,34.14 63.17,32.16 70.33,32.16 71.02,32.84 71.02,35.05 69.88,36.2 69.88,36.96 C51.1 | v47.93,34.67 47.32,34.06 47.32,33.98 47.02,33.68 44.12,33.68 43.66,34.14 42.67,34.14 39.17,30.63 39.17,25.98 33.91,20.73 33.91,15.47 33.87,15.43 | 33.87,15.43 33.38,14.94 27.36,14.94 27.05,15.24 25.6,15.24 23.77,17.07 19.96,17.07 | 19.96,17.07 18.59,17.07 18.55,17.03 | 18.55,17.03 17.53,16 S6.4 | 18.55,17.03 16.69,18.9 16.69,20.27 R61.1 | R71.1 51.51,8.38 v51.13,8 | v39.47,10.97 38.33,10.97 33.87,15.43 | 19.96,17.07 19.96,12.27 19.28,11.58 18.06,11.58 16.38,9.91 16.38,8.69 15.7,8 10.67,8 6.02,12.65 5.41,12.65 X17.2
  Bottom 0.152: v57.45,34.14 48.46,34.14 v47.93,34.67 | v51.13,8 48.16,10.97 v39.47,10.97
N$300
  Top 0.152: 52.81,12.27 55.32,12.27 55.85,12.8 R60.1 | 52.81,12.27 51.51,12.27 R71.2 | 52.81,12.27 52.81,8.38 55.85,5.33 55.85,2.59 SV7.1
OUTP_3  (via drill 0.35)
  Top 0.152: v57.45,21.26 57.61,21.11 57.61,19.96 IC15.5 | v46.94,20.95 v52.96,20.95 | v34.9,29.72 34.75,29.72 30.18,34.29 v30.18,35.59
  Bottom 0.152: v57.45,21.26 53.26,21.26 v52.96,20.95 | v46.94,20.95 44.2,20.95 38.79,26.36 37.95,26.36 37.64,26.67 37.64,26.98 v34.9,29.72 | v30.18,35.59 18.52,47.24 18.52,51.28 15.24,54.56 IC1.4
PWM8  (via drill 0.35)
  Top 0.152: v52.88,24 52.96,23.93 54.18,23.93 IC15.43 | v54.41,15.32 65.84,15.32 v65.99,15.16 | v78.03,13.34 79.93,15.24 SL2.2
  Bottom 0.152: v52.88,24 52.88,22.25 51.82,21.18 51.82,17.91 v54.41,15.32 | v65.99,15.16 70.79,15.16 72.62,13.34 v78.03,13.34
RELAYL1  (via drill 0.35)
  Top 0.152: v56.92,18.06 56.24,18.75 56.24,19.89 IC15.2 | v67.97,18.14 75.13,18.14 75.74,18.75 76.05,18.75 79.02,21.72 79.02,25.6 85.8,32.38 85.8,41.6 v86.18,41.99 | v63.55,64.16 53.72,64.16 50.29,67.59 50.29,67.89 49.23,68.96 41.68,68.96 36.8,64.08 30.63,64.08 29.79,63.25 29.79,61.49 24.46,56.16 22.48,56.16 21.26,54.94 21.26,53.57 20.73,53.03 19.05,53.03 18.97,53.11 18.21,53.11 18.14,53.03 14.25,53.03 14.17,53.11 13.18,53.11 13.11,53.03 9.14,53.03 7.62,54.56 IC1.1
  Bottom 0.152: v56.92,18.06 57.61,17.37 57.61,12.34 57.45,12.19 57.45,11.58 58.67,10.36 60.27,10.36 65.99,16.08 65.99,16.15 v67.97,18.14 | v86.18,41.99 86.18,42.44 82.22,46.41 82.22,49.91 77.88,54.25 71.17,54.25 65.23,60.2 64.77,60.2 63.55,61.42 v63.55,64.16
RELAYL2  (via drill 0.35)
  Top 0.152: v49.38,14.25 53.03,17.91 53.03,18.52 55.4,20.88 56.46,20.88 56.62,20.73 56.62,19.96 IC15.3 | v49.38,11.96 46.63,9.22 46.63,7.85 43.13,4.34 41.83,4.34 39.32,1.83 15.16,1.83 13.64,3.35 13.64,4.95 11.58,7.01 v11.12,7.01
  Bottom 0.152: v49.38,11.96 v49.38,14.25 | v11.12,7.01 11.12,16.15 4.27,23.01 4.27,38.86 10.13,44.73 10.13,54.56 IC1.2
RX1
  Bottom 0.152: IC17.13 38.1,16.54 37.49,16.54 35.66,18.36 23.01,18.36 14.1,9.45 14.1,5.18 12.72,3.81 RS232-3.3
RX2
  Bottom 0.152: RS-232-3.3 29.57,6.71 45.49,6.71 47.62,8.84 48.23,8.84 IC17.8
SELECT_B  (via drill 0.35)
  Top 0.152: v53.57,27.89 53.19,27.51 53.19,26.59 53.34,26.44 54.18,26.44 IC15.38 | v73.91,25.83 74.83,25.83 78.49,29.49 v81.99,29.49 | v100.89,20.65 100.89,20.27 100.66,20.04 100.66,19.13 U$1.OUT3
  Bottom 0.152: v53.57,27.89 56.54,30.86 57.15,30.86 57.45,30.56 57.45,27.43 60.27,24.61 72.69,24.61 v73.91,25.83 | v81.99,29.49 91.06,29.49 98.68,37.11 102.03,37.11 102.49,36.65 102.49,24.92 100.89,23.32 v100.89,20.65
SL3_PIN3  (via drill 0.35)
  Top 0.152: v98.68,16 98.98,16.31 101.27,16.31 103.17,18.21 103.17,19.05 U$1.OUT7 | v81.23,12.72 80.85,12.72 75.36,7.24 69.49,7.24 67.36,5.11 SL3.3
  Bottom 0.152: v98.68,16 98.22,16 94.94,12.72 v81.23,12.72
SW0  (via drill 0.35)
  Top 0.152: v51.13,24.84 52.58,23.39 54.18,23.39 IC15.44 | v60.58,34.75 61.04,34.75 63.02,32.77 v70.03,32.77 | v106.45,30.1 v90.75,30.1 | v102.95,20.65 102.95,20.34 102.64,20.04 102.64,19.13 U$1.OUT6
  Bottom 0.152: v51.13,24.84 51.13,27.2 49.3,29.03 49.3,32.08 50.75,33.53 59.36,33.53 v60.58,34.75 | v70.03,32.77 81,32.77 81.53,33.3 86.26,33.3 89.46,30.1 v90.75,30.1 | v106.45,30.1 107.59,28.96 107.59,25.91 106.98,25.3 106.98,24.69 v102.95,20.65 103.02,20.65 103.17,20.5 103.17,15.93 97.69,10.44 97.61,10.44 96.32,9.14 84.43,9.14 78.72,3.43 71.93,3.43 70.33,5.03 69.88,5.03 SL3.2
TX1
  Bottom 0.152: RS232-3.2 16.92,2.13 18.21,2.13 18.75,2.67 18.75,10.97 25.83,18.06 33.45,18.06 34.98,16.54 35.51,16.54 IC17.14
TX2
  Top 0.152: IC17.7 45.72,8.69 39.17,2.13 25.83,2.13 24.16,3.81 RS-232-3.2
ULN2803_24VDC
  Top 0.3: F1.1 9.07,67.28 9.68,67.28 14.25,62.71 14.25,61.19 14.86,60.58 25.91,60.58 27.66,62.33 IC1.10 27.89,62.26 25.76,64.39 25.76,65.99 C6.1 25.68,66.14 24.16,67.67 24.16,72.39 OUTP.8
V_BAT  (via drill 0.35)
  Top 0.152: v60.88,31.32 60.88,29.49 61.11,29.26 61.11,28.42 IC15.25 | v50.75,31.09 v52.05,32.38 | v49.91,29.87 41.83,29.87 v41.3,30.4 | v33.3,32.23 31.01,34.52 v30.94,34.52
  Bottom 0.152: v60.88,31.32 59.82,31.32 58.14,32.99 52.65,32.99 v52.05,32.38 | v50.75,31.09 50.75,30.71 v49.91,29.87 | v41.3,30.4 36.96,34.75 36.35,34.75 35.13,33.53 35.13,32.69 34.67,32.23 v33.3,32.23 | v30.94,34.52 25.76,34.52 16.54,25.3 16.54,24.16 R4.2
V_BBAT  (via drill 0.35)
  Top 0.152: v38.02,23.93 37.19,23.09 37.19,19.96 39.01,18.14 39.01,16.15 41.53,13.64 49.68,13.64 49.99,13.95 49.99,14.1 52.58,16.69 54.86,16.69 55.09,16.46 58.98,16.46 60.12,17.6 60.12,19.89 IC15.10 | R7.2 v34.29,31.09
  Bottom 0.152: v38.02,23.93 38.02,24.31 34.29,28.04 v34.29,31.09
V_CC  (via drill 0.35)
  Top 0.152: v63.7,29.41 63.7,26.67 63.48,26.44 62.71,26.44 IC15.23 | v62.48,34.67 59.66,37.49 v59.66,38.02 | v25.38,27.13 25.38,24.16 R3.2
  Bottom 0.152: v63.7,29.41 62.48,30.63 v62.48,34.67 | v59.66,38.02 51.97,38.02 50.22,39.78 38.02,39.78 v25.38,27.13
V_CMODE  (via drill 0.35)
  Top 0.152: v56.31,31.77 57.45,30.63 57.45,29.95 57.23,29.72 57.23,28.42 IC15.33 | v49.91,31.77 48.16,31.77 46.94,32.99 43.2,32.99 R6.2
  Bottom 0.152: v49.91,31.77 v56.31,31.77
V_INVER  (via drill 0.35)
  Top 0.152: v63.55,16.46 65.84,18.75 65.84,22.17 65.15,22.86 62.71,22.86 IC15.16 | v59.51,12.42 59.51,11.58 56.84,8.91 v53.42,8.91 | v14.48,18.82 15.62,19.96 15.62,32.16 16.46,32.99 R9.2
  Bottom 0.152: v59.51,12.42 v63.55,16.46 | v53.42,8.91 50.67,8.91 48.01,11.58 36.27,11.58 33.91,9.22 33.91,7.85 33.07,7.01 22.71,7.01 19.05,3.35 19.05,2.52 18.36,1.83 12.57,1.83 11.73,2.67 11.73,13.18 14.48,15.93 v14.48,18.82
V_LIGHT_SEN  (via drill 0.35)
  Top 0.152: v65.3,27.74 65.3,24.46 64.24,23.39 62.71,23.39 IC15.17 | v57.53,36.58 56.69,36.58 55.78,37.49 55.78,38.02 v55.17,38.63 | v48.62,41.83 47.55,41.83 46.94,42.44 46.94,44.04 v46.25,44.73 | v13.87,52.5 v18.67,52.5
  Bottom 0.152: v65.3,27.74 64.47,27.74 61.87,30.33 61.87,35.28 60.58,36.58 v57.53,36.58 | v55.17,38.63 51.82,38.63 v48.62,41.83 | v46.25,44.73 26.44,44.73 v18.67,52.5 | v13.87,52.5 13.87,40.39 7.62,34.14 R10.2
V_PV  (via drill 0.35)
  Top 0.152: v39.78,27.96 39.78,26.36 40.31,25.83 40.92,25.83 43.81,28.73 53.65,28.73 54.25,28.12 54.63,28.12 56.84,25.91 58.98,25.91 60.66,27.58 60.66,28.35 IC15.26
  Bottom 0.152: v39.78,27.96 38.33,27.96 34.59,31.7 33.98,31.7 28.73,26.44 28.73,26.29 23.77,21.34 10.36,21.34 7.62,24.08 R5.2
VCC  (via drill 0.35)
  Top 0.152: 72.28,13.91 73.46,12.72 R66.1 | 72.28,13.91 72.24,13.95 71.17,13.95 JMP6.2 | C65.1 72.24,22.86 71.02,21.64 Q3.1 | Q3.4 68.73,21.64 70.94,21.64 Q3.1 | v72.47,14.4 72.31,14.25 72.31,13.95 72.28,13.91 | v71.02,19.43 71.02,21.57 Q3.1 | v36.04,65.3 35.51,65.84 34.29,65.84 C68.1 | v36.04,60.81 34.82,59.59 C69.1 | v26.21,20.8 30.48,16.54 IC17.16 | v29.64,26.44 29.64,35.2 29.57,35.28 v29.57,46.25 | v66.6,15.85 54.79,15.85 54.71,15.93 53.19,15.93 v53.03,15.77 | v46.33,18.75 v50.06,18.75
  Bottom 0.152: 72.47,15.85 72.47,17.98 v71.02,19.43 | 72.47,15.85 v72.47,14.4 | v36.04,65.3 v36.04,60.81 36.04,57.61 29.57,51.13 v29.57,46.25 | v26.21,20.8 26.21,23.01 v29.64,26.44 29.64,26.36 32.69,23.32 41.38,23.32 45.95,18.75 v46.33,18.75 | v66.6,15.85 72.47,15.85 | v50.06,18.75 v53.03,15.77
VDD  (via drill 0.35)
  Top 0.3: IC16.3 66.98,34.29 66.98,36.88 IC16.4 67.06,37.03 67.59,37.57 67.59,38.18 | 67.59,38.18 67.59,40.23 | 67.59,40.23 67.59,43.13 C10.1 | 77.5,38.1 77.5,35.59 D1.C | 77.5,38.1 80.01,40.62 IC4.3 | 67.59,38.18 77.42,38.18 77.5,38.1 | v52.81,37.26 50.83,37.26 L2.2 | v56.92,37.26 57.38,37.26 58.22,38.1 C58.1 | v15.01,21.95 13.87,20.8 13.87,20.34 R61.2 | v66.83,40.23 67.59,40.23 | INP.8 97.84,2.59 74.98,2.59 REFVDD.TP 74.83,2.59 65.08,2.59 63.7,3.96 63.7,6.78 65.99,9.07 65.99,10.97 65.3,11.66 63.78,11.66 63.4,12.04 63.4,12.42 v63.32,12.5 61.49,12.5 61.04,12.95 L1.1 60.96,13.11 57.76,13.11 56.84,14.02 51.13,14.02 50.29,13.18 50.29,5.64 53.34,2.59 SV7.2 | 94.64,9.98 95.94,8.69 v97.23,8.69 | 94.64,9.98 91.97,12.65 89.92,12.65 C4.2 | 75.59,13.41 76.28,12.72 R66.2 | 75.59,13.41 75.06,13.95 73.91,13.95 72.24,15.62 71.17,15.62 JMP6.1 | v74.91,12.72 75.59,13.41 | v76.81,65.08 77.42,65.68 80.01,65.68 C1.1 | C59.1 57.3,58.45 57.3,59.74 59.51,61.95 59.51,62.48 60.5,63.48 63.78,63.48 65.38,61.87 J1.12 | 100.28,65.99 110.49,65.99 SL4.2 | SPI_IN.7 100.28,65.99 | 100.28,65.99 97.84,68.43 97.84,72.39 SPI_OUT.7 | 98.45,19.13 98.68,19.13 U$1.VCC | 98.45,19.13 96.16,19.13 88.62,26.67 R33.2 | 98.45,19.13 v98.45,20.65 | 93.95,38.94 93.95,49.15 92.35,50.75 J2.2 | 93.95,38.94 93.95,35.28 C5.1 93.88,35.13 92.89,34.14 92.89,32.54 93.34,32.08 v97.23,32.08 | v94.72,10.06 94.64,9.98 | v93.88,38.94 93.95,38.94
  Bottom 0.3: v15.01,21.95 21.18,21.95 38.63,39.4 49.99,39.4 52.05,37.34 52.73,37.34 v52.81,37.26 v56.92,37.26 57,37.34 59.97,37.34 62.87,40.23 v66.83,40.23 | v97.23,8.69 97.23,8.15 100.28,5.11 INP.8 | v74.91,12.72 63.55,12.72 v63.32,12.5 | v76.81,65.08 74.6,65.08 73,63.48 67.06,63.48 65.46,61.87 J1.12 65.46,61.72 65.46,61.34 72.16,54.63 88.47,54.63 92.2,50.9 J2.2 92.35,50.83 97.77,56.24 97.77,63.48 SPI_IN.7 | v97.23,32.08 101.42,27.89 IC2.2 101.58,27.89 101.58,24.61 98.45,21.49 v98.45,20.65 98.45,20.57 100.66,18.36 100.66,16 v94.72,10.06 | v93.88,38.94 83.29,38.94 81.61,40.62 80.01,40.62 IC4.3
VREF4.1  (via drill 0.35)
  Top 0.152: VREF4095.TP 65.99,39.32 65.99,37.03 IC16.5 65.99,36.96 65.15,36.96 IC16.6 65.08,36.88 v64.24,36.04 | v63.78,31.24 62.71,30.18 62.71,26.9 IC15.24 | v72.24,45.26 72.24,46.63 | 72.24,46.63 72.24,46.94 C57.1 72.24,46.63 | v50.44,49.3 47.02,52.73 47.02,53.42 C60.1 | 72.24,46.63 v70.87,46.63
  Bottom 0.152: v63.78,31.24 63.78,35.59 v64.24,36.04 64.24,36.73 72.24,44.73 v72.24,45.26 | v50.44,49.3 50.44,46.79 52.2,45.03 58.6,45.03 60.2,46.63 v70.87,46.63
VREF5V
  Top 0.152: IC3.6 83.82,54.18 84.73,53.26 84.73,49.15 84.2,48.62 84.2,47.02 C7.1 | VREF5VREF.TP 73.61,57.15 73.61,57.84 69.65,61.8 J1.14
  Bottom 0.152: IC3.6 82.6,57.15 77.95,61.8 69.65,61.8 J1.14
VSS  (via drill 0.35)
  Top 0.3: 10.67,13.64 12.95,15.93 S6.2 | 10.67,13.64 9.75,12.72 7.39,12.72 X17.1 | 23.39,5.56 29.64,5.56 32.08,3.12 33.91,3.12 34.9,4.12 36.8,4.12 C61.2 36.96,4.19 v40.31,4.19 | 23.39,5.56 21.64,3.81 RS-232-3.1 RS232-3.1 | C62.2 22.86,12.95 21.79,11.89 21.79,7.16 23.39,5.56 | 10.67,13.64 15.24,9.07 S6.6 | v57,17.07 58.14,18.21 58.14,19.89 IC15.6 58.14,19.96 58.14,21.57 58.06,21.64 v58.06,22.48 | v57.45,26.52 58.14,27.2 58.14,28.35 IC15.31 | v56.16,6.4 58.22,6.4 C54.2 | v56.84,30.25 54.63,32.46 54.63,34.14 C53.2 | 85.19,21.49 88.01,21.49 92.51,16.99 93.95,16.99 LED5.C | SL1.1 85.19,21.49 | R67.2 73.46,16.54 72.08,16.54 71.93,16.69 69.57,16.69 68.66,15.77 JMP5.1 68.58,15.62 67.51,15.62 64.77,12.88 C52.2 64.85,12.72 65.46,12.12 65.53,12.12 66.67,10.97 66.67,8.53 67.06,8.15 75.67,8.15 80.92,13.41 81.53,13.41 82.22,12.72 | SL3.1 72.39,5.11 73.61,6.33 74.91,6.33 REFVSS.TP | 83.67,14.17 82.6,15.24 SL2.1 82.68,15.32 85.11,17.75 85.11,21.41 85.19,21.49 | 83.67,14.17 85.11,12.72 87.94,12.72 C4.1 | 83.67,14.17 82.22,12.72 | 82.22,12.72 81.53,12.04 81.31,12.04 75.67,6.4 75.06,6.4 74.98,6.33 REFVSS.TP | 75.21,65.68 71.86,69.04 67.13,69.04 65.46,67.36 J1.11 | 75.21,65.68 77.04,63.86 80.01,63.86 C1.2 | R23.2 53.03,47.02 53.03,50.75 C12.2 | C12.2 53.03,50.9 53.03,54.56 C8.2 53.11,54.71 54.41,56.01 54.41,58.37 C59.2 | R21.2 58.06,43.2 58.06,46.94 R22.2 58.14,47.09 58.14,47.78 v60.58,50.22 | v54.71,50.14 53.11,50.14 C12.2 | 75.21,65.68 73,63.48 68.89,63.48 67.06,61.65 67.06,56.46 | 67.06,56.46 67.06,55.63 IC5.2 | R30.2 17.45,47.02 13.72,50.75 6.4,50.75 SV8.1 | 29.34,66.06 31.47,66.06 31.62,66.22 LED8.C
  Top 0.3: 29.34,66.06 27.66,66.06 C6.2 27.66,66.22 27.66,71.4 OUTP.9 | R27.2 32.77,47.02 34.06,47.02 35.13,48.08 36.65,48.08 37.72,47.02 R26.2 37.87,46.94 38.94,45.87 41.76,45.87 42.82,46.94 R25.2 42.9,47.09 v42.9,48.84 | R24.2 47.93,47.02 47.93,49.68 47.02,50.6 C60.2 46.86,50.75 v43.2,50.75 | v26.44,53.19 22.55,49.3 22.55,47.02 R29.2 | 27.66,52.73 27.66,54.33 IC1.9 | 27.66,52.73 27.66,47.02 R28.2 | 27.66,52.73 37.26,52.73 39.09,54.56 39.32,54.56 IC6.2 | v29.34,64.16 29.34,66.06 | U$1.GND 104.47,11.35 104.47,6.71 102.87,5.11 INP.9 103.02,5.11 104.93,3.2 107.21,3.2 111.56,7.54 111.56,10.82 110.49,11.89 LED4.C 110.49,14.1 111.56,15.16 111.56,18.44 110.49,19.51 LED3.C 110.57,19.66 110.57,21.79 111.56,22.78 111.56,26.06 110.57,27.05 LED2.C | C67.2 94.03,26.82 97.99,26.82 99.06,27.89 IC2.1 99.14,27.81 99.67,27.81 101.19,26.29 109.5,26.29 110.34,27.13 110.41,27.13 LED2.C | 96.09,33.38 109.12,33.38 109.73,33.98 | 96.09,33.38 94.03,33.38 C5.2 | 109.73,33.98 110.49,34.75 LED1.C 110.49,34.82 | 109.73,33.98 111.56,32.16 111.56,30.4 110.49,29.34 LED2.C | C51.2 69.8,34.14 69.04,33.38 66.52,33.38 66.14,33.76 66.14,34.14 IC16.2 65.99,34.29 65.15,34.29 IC16.1 65,34.21 61.11,38.1 C58.2 61.19,38.18 64.39,41.38 64.39,43.05 C9.2 64.47,43.2 65.76,43.2 66.83,44.27 68.43,44.27 69.49,43.2 C10.2 69.65,43.13 70.87,41.91 | 70.87,41.91 73.99,38.79 75.36,38.79 77.19,40.62 77.42,40.62 IC4.2 | C57.2 75.13,46.94 77.27,46.94 78.33,45.87 79.78,45.87 80.85,46.94 C11.2 81,46.94 82.3,46.94 83.36,45.87 84.96,45.87 86.03,46.94 C7.2 86.11,47.09 86.33,47.32 86.33,49.53 IC3.4
  Top 0.3: 70.87,41.91 75.13,46.18 75.13,46.79 C57.2 | 96.09,33.38 96.09,49.07 97.77,50.75 J2.1 | 67.06,56.46 72.31,56.46 73.84,54.94 73.84,48.23 74.98,47.09 C57.2 | 74.98,6.4 REFVSS.TP
  Bottom 0.3: S6.6 15.24,6.33 17.75,3.81 RS232-3.1 | v57,17.07 57,12.72 55.4,11.12 55.4,7.16 | 55.4,7.16 50.83,2.59 SV7.3 50.67,2.59 48.84,4.42 42.75,4.42 42.52,4.19 v40.31,4.19 | v58.06,22.48 58.06,23.47 57.45,24.08 v57.45,26.52 56.84,27.13 v56.84,30.25 | 55.4,7.16 v56.16,6.4 56.24,6.48 64.01,6.48 64.39,6.86 70.64,6.86 72.39,5.11 SL3.1 | IC5.2 61.65,50.22 v60.58,50.22 60.5,50.14 v54.71,50.14 54.63,50.22 43.74,50.22 v43.2,50.75 | v26.44,53.19 27.89,54.63 IC1.9 | v43.2,50.75 39.4,54.56 IC6.2 | v42.9,48.84 42.9,50.44 v43.2,50.75 | v29.34,64.16 29.34,57.76 32.16,54.94 32.16,54.33 31.77,53.95 28.65,53.95 28.04,54.56 IC1.9 | SV8.1 6.4,50.83 6.4,51.36 9.14,54.1 9.14,55.63 9.75,56.24 18.21,56.24 19.36,55.09 19.36,53.49 19.89,52.96 20.73,52.96 21.87,54.1 21.87,55.7 22.4,56.24 25.83,56.24 27.58,54.48 IC1.9 | D1.A 80.01,38.1 IC4.2 | 102.18,65.38 105.84,65.38 107.67,63.55 110.49,63.55 SL4.1 | 102.18,65.38 100.36,63.55 SPI_IN.8 100.28,63.4 100.28,57.53 97.84,55.09 97.84,50.9 J2.1 97.77,50.75 94.64,50.75 92.96,49.07 86.87,49.07 86.41,49.53 IC3.4 | 102.18,65.38 100.36,67.21 100.36,72.39 SPI_OUT.8 | SL1.1 82.6,24.16 95.33,24.16 99.06,27.89 IC2.1

## Text on the board
Top: POWER | MBMC CPU/IO BOARD | FGB@NSASPOOK 2.0
200bmp: /fred/Downloads/mchp.bmp